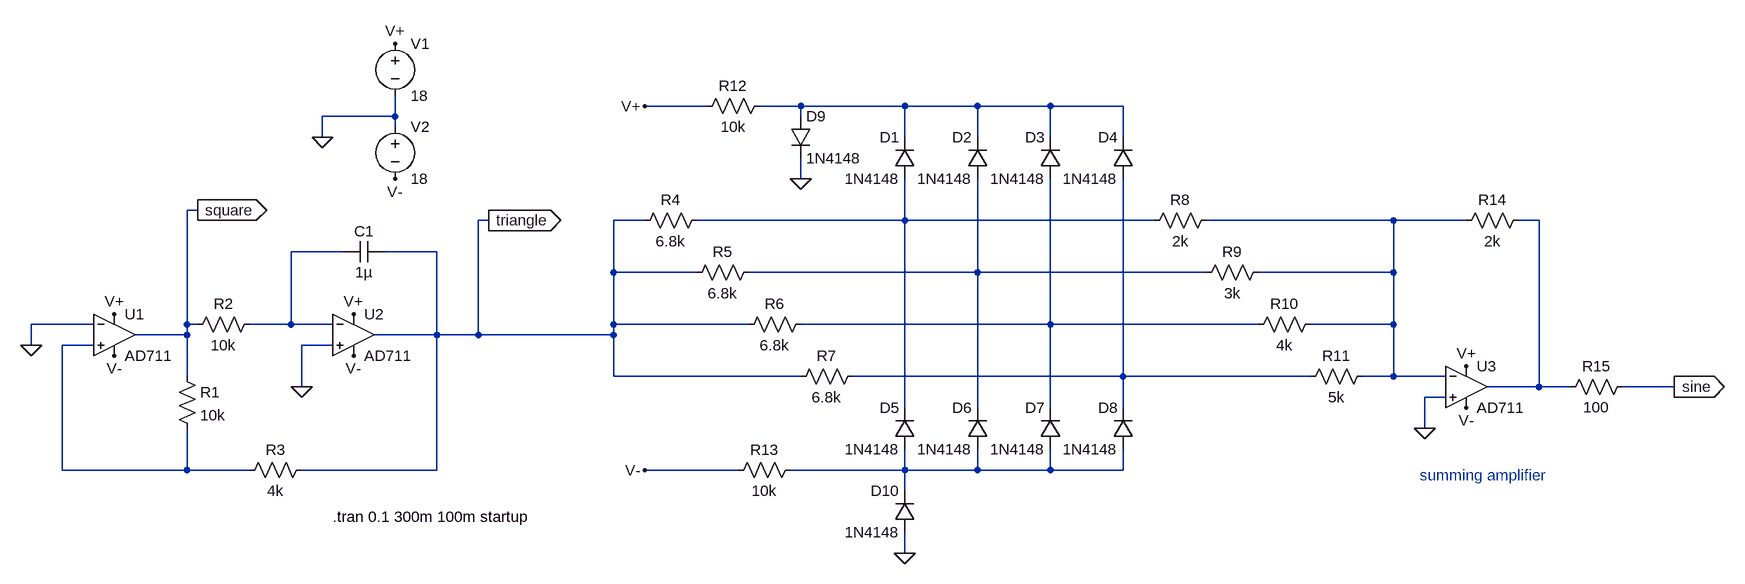
[diagram p0: schematic final project NEW.asc]
final project NEW.asc, the LTspice schematic file:
Version 4
SHEET 1 1976 848
WIRE 400 144 304 144
WIRE 544 144 480 144
WIRE 704 144 544 144
WIRE 816 144 704 144
WIRE 928 144 816 144
WIRE 1040 144 928 144
WIRE -80 160 -80 128
WIRE -80 160 -192 160
WIRE 544 160 544 144
WIRE -80 176 -80 160
WIRE -192 192 -192 160
WIRE 704 192 704 144
WIRE 816 192 816 144
WIRE 928 192 928 144
WIRE 1040 192 1040 144
WIRE 544 256 544 224
WIRE -384 304 -400 304
WIRE 64 320 48 320
WIRE 304 320 256 320
WIRE 704 320 704 256
WIRE 704 320 384 320
WIRE 1088 320 704 320
WIRE 1456 320 1168 320
WIRE 1568 320 1456 320
WIRE 1680 320 1648 320
WIRE -160 368 -240 368
WIRE -16 368 -96 368
WIRE 256 400 256 320
WIRE 384 400 256 400
WIRE 816 400 816 256
WIRE 816 400 464 400
WIRE 1168 400 816 400
WIRE 1456 400 1456 320
WIRE 1456 400 1248 400
WIRE -544 480 -640 480
WIRE -400 480 -400 304
WIRE -384 480 -400 480
WIRE -240 480 -240 368
WIRE -240 480 -304 480
WIRE -176 480 -240 480
WIRE 256 480 256 400
WIRE 464 480 256 480
WIRE 928 480 928 256
WIRE 928 480 544 480
WIRE 1248 480 928 480
WIRE 1456 480 1456 400
WIRE 1456 480 1328 480
WIRE -400 496 -400 480
WIRE -400 496 -480 496
WIRE -16 496 -16 368
WIRE -16 496 -112 496
WIRE 48 496 48 320
WIRE 48 496 -16 496
WIRE 256 496 256 480
WIRE 256 496 48 496
WIRE -640 512 -640 480
WIRE -544 512 -592 512
WIRE -176 512 -224 512
WIRE -400 560 -400 496
WIRE 256 560 256 496
WIRE 544 560 256 560
WIRE 1040 560 1040 256
WIRE 1040 560 624 560
WIRE 1328 560 1040 560
WIRE 1456 560 1456 480
WIRE 1456 560 1408 560
WIRE 1536 560 1456 560
WIRE -224 576 -224 512
WIRE 1680 576 1680 320
WIRE 1680 576 1600 576
WIRE 1728 576 1680 576
WIRE 1888 576 1808 576
WIRE 1536 592 1504 592
WIRE 704 608 704 320
WIRE 816 608 816 400
WIRE 928 608 928 480
WIRE 1040 608 1040 560
WIRE 1504 640 1504 592
WIRE -592 704 -592 512
WIRE -400 704 -400 640
WIRE -400 704 -592 704
WIRE -304 704 -400 704
WIRE -16 704 -16 496
WIRE -16 704 -224 704
WIRE 448 704 304 704
WIRE 704 704 704 672
WIRE 704 704 528 704
WIRE 816 704 816 672
WIRE 816 704 704 704
WIRE 928 704 928 672
WIRE 928 704 816 704
WIRE 1040 704 1040 672
WIRE 1040 704 928 704
WIRE 704 736 704 704
WIRE 704 832 704 800
FLAG -192 192 0
FLAG -640 512 0
FLAG -224 576 0
FLAG -384 304 square
IOPIN -384 304 Out
FLAG 64 320 triangle
IOPIN 64 320 Out
FLAG 704 832 0
FLAG 544 256 0
FLAG 304 704 V-
FLAG 304 144 V+
FLAG -512 464 V+
FLAG -144 464 V+
FLAG -512 528 V-
FLAG -144 528 V-
FLAG 1568 544 V+
FLAG 1568 608 V-
FLAG 1504 640 0
FLAG 1888 576 sine
IOPIN 1888 576 Out
FLAG -80 48 V+
FLAG -80 256 V-
SYMBOL voltage -80 32 R0
SYMATTR InstName V1
SYMATTR Value 18
SYMBOL voltage -80 160 R0
SYMATTR InstName V2
SYMATTR Value 18
SYMBOL OpAmps/AD711 -512 432 R0
SYMATTR InstName U1
SYMBOL OpAmps/AD711 -144 432 R0
SYMATTR InstName U2
SYMBOL Res -416 544 R0
SYMATTR InstName R1
SYMATTR Value 10k
SYMBOL Res -288 464 R90
WINDOW 0 0 56 VBottom 2
WINDOW 3 32 56 VTop 2
SYMATTR InstName R2
SYMATTR Value 10k
SYMBOL Res -208 688 R90
WINDOW 0 0 56 VBottom 2
WINDOW 3 32 56 VTop 2
SYMATTR InstName R3
SYMATTR Value 4k
SYMBOL Cap -96 352 R90
WINDOW 0 0 32 VBottom 2
WINDOW 3 32 32 VTop 2
SYMATTR InstName C1
SYMATTR Value 1µ
SYMBOL Res 400 304 R90
WINDOW 0 0 56 VBottom 2
WINDOW 3 32 56 VTop 2
SYMATTR InstName R4
SYMATTR Value 6.8k
SYMBOL Res 480 384 R90
WINDOW 0 0 56 VBottom 2
WINDOW 3 32 56 VTop 2
SYMATTR InstName R5
SYMATTR Value 6.8k
SYMBOL Res 560 464 R90
WINDOW 0 0 56 VBottom 2
WINDOW 3 32 56 VTop 2
SYMATTR InstName R6
SYMATTR Value 6.8k
SYMBOL Res 640 544 R90
WINDOW 0 0 56 VBottom 2
WINDOW 3 32 56 VTop 2
SYMATTR InstName R7
SYMATTR Value 6.8k
SYMBOL Res 1184 304 R90
WINDOW 0 0 56 VBottom 2
WINDOW 3 32 56 VTop 2
SYMATTR InstName R8
SYMATTR Value 2k
SYMBOL Res 1264 384 R90
WINDOW 0 0 56 VBottom 2
WINDOW 3 32 56 VTop 2
SYMATTR InstName R9
SYMATTR Value 3k
SYMBOL Res 1344 464 R90
WINDOW 0 0 56 VBottom 2
WINDOW 3 32 56 VTop 2
SYMATTR InstName R10
SYMATTR Value 4k
SYMBOL Res 1424 544 R90
WINDOW 0 0 56 VBottom 2
WINDOW 3 32 56 VTop 2
SYMATTR InstName R11
SYMATTR Value 5k
SYMBOL Res 496 128 R90
WINDOW 0 0 56 VBottom 2
WINDOW 3 32 56 VTop 2
SYMATTR InstName R12
SYMATTR Value 10k
SYMBOL Res 544 688 R90
WINDOW 0 0 56 VBottom 2
WINDOW 3 32 56 VTop 2
SYMATTR InstName R13
SYMATTR Value 10k
SYMBOL Res 1664 304 R90
WINDOW 0 0 56 VBottom 2
WINDOW 3 32 56 VTop 2
SYMATTR InstName R14
SYMATTR Value 2k
SYMBOL diode 720 256 R180
WINDOW 0 24 64 Left 2
WINDOW 3 24 0 Left 2
SYMATTR InstName D1
SYMATTR Value 1N4148
SYMBOL diode 832 256 R180
WINDOW 0 24 64 Left 2
WINDOW 3 24 0 Left 2
SYMATTR InstName D2
SYMATTR Value 1N4148
SYMBOL diode 944 256 R180
WINDOW 0 24 64 Left 2
WINDOW 3 24 0 Left 2
SYMATTR InstName D3
SYMATTR Value 1N4148
SYMBOL diode 1056 256 R180
WINDOW 0 24 64 Left 2
WINDOW 3 24 0 Left 2
SYMATTR InstName D4
SYMATTR Value 1N4148
SYMBOL diode 720 672 R180
WINDOW 0 24 64 Left 2
WINDOW 3 24 0 Left 2
SYMATTR InstName D5
SYMATTR Value 1N4148
SYMBOL diode 832 672 R180
WINDOW 0 24 64 Left 2
WINDOW 3 24 0 Left 2
SYMATTR InstName D6
SYMATTR Value 1N4148
SYMBOL diode 944 672 R180
WINDOW 0 24 64 Left 2
WINDOW 3 24 0 Left 2
SYMATTR InstName D7
SYMATTR Value 1N4148
SYMBOL diode 1056 672 R180
WINDOW 0 24 64 Left 2
WINDOW 3 24 0 Left 2
SYMATTR InstName D8
SYMATTR Value 1N4148
SYMBOL diode 528 160 R0
SYMATTR InstName D9
SYMATTR Value 1N4148
SYMBOL diode 720 800 R180
WINDOW 0 24 64 Left 2
WINDOW 3 24 0 Left 2
SYMATTR InstName D10
SYMATTR Value 1N4148
SYMBOL OpAmps/AD711 1568 512 R0
SYMATTR InstName U3
SYMBOL Res 1824 560 R90
WINDOW 0 0 56 VBottom 2
WINDOW 3 32 56 VTop 2
SYMATTR InstName R15
SYMATTR Value 100
TEXT 1496 712 Left 2 ;summing amplifier
TEXT -176 776 Left 2 !.tran 0.1 300m 100m startup

The netlist it stands for:
* final project NEW.asc
V1 V+ 0 18
V2 0 V- 18
XU1 N008 0 V+ V- square AD712  ; AD711, pins In+ In- V+ V- OUT
XU2 0 N005 V+ V- triangle AD712  ; AD711, pins In+ In- V+ V- OUT
R1 square N008 10k
R2 N005 square 10k
R3 triangle N008 4k
C1 triangle N005 1µ
R4 N002 triangle 6.8k
R5 N006 triangle 6.8k
R6 N007 triangle 6.8k
R7 N009 triangle 6.8k
R8 N003 N002 2k
R9 N003 N006 3k
R10 N003 N007 4k
R11 N003 N009 5k
R12 N001 V+ 10k
R13 N010 V- 10k
R14 N004 N003 2k
D1 N002 N001 1N4148
D2 N006 N001 1N4148
D3 N007 N001 1N4148
D4 N009 N001 1N4148
D5 N010 N002 1N4148
D6 N010 N006 1N4148
D7 N010 N007 1N4148
D8 N010 N009 1N4148
D9 N001 0 1N4148
D10 0 N010 1N4148
XU3 0 N003 V+ V- N004 AD712  ; AD711, pins In+ In- V+ V- OUT
R15 sine N004 100
.model D D
.lib standard.dio
* summing amplifier
.tran 0.1 300m 100m startup
.lib ADI1.lib
.backanno
.end